# EAGLE design LoRaBaseBoard (EAGLE 9.6.2)
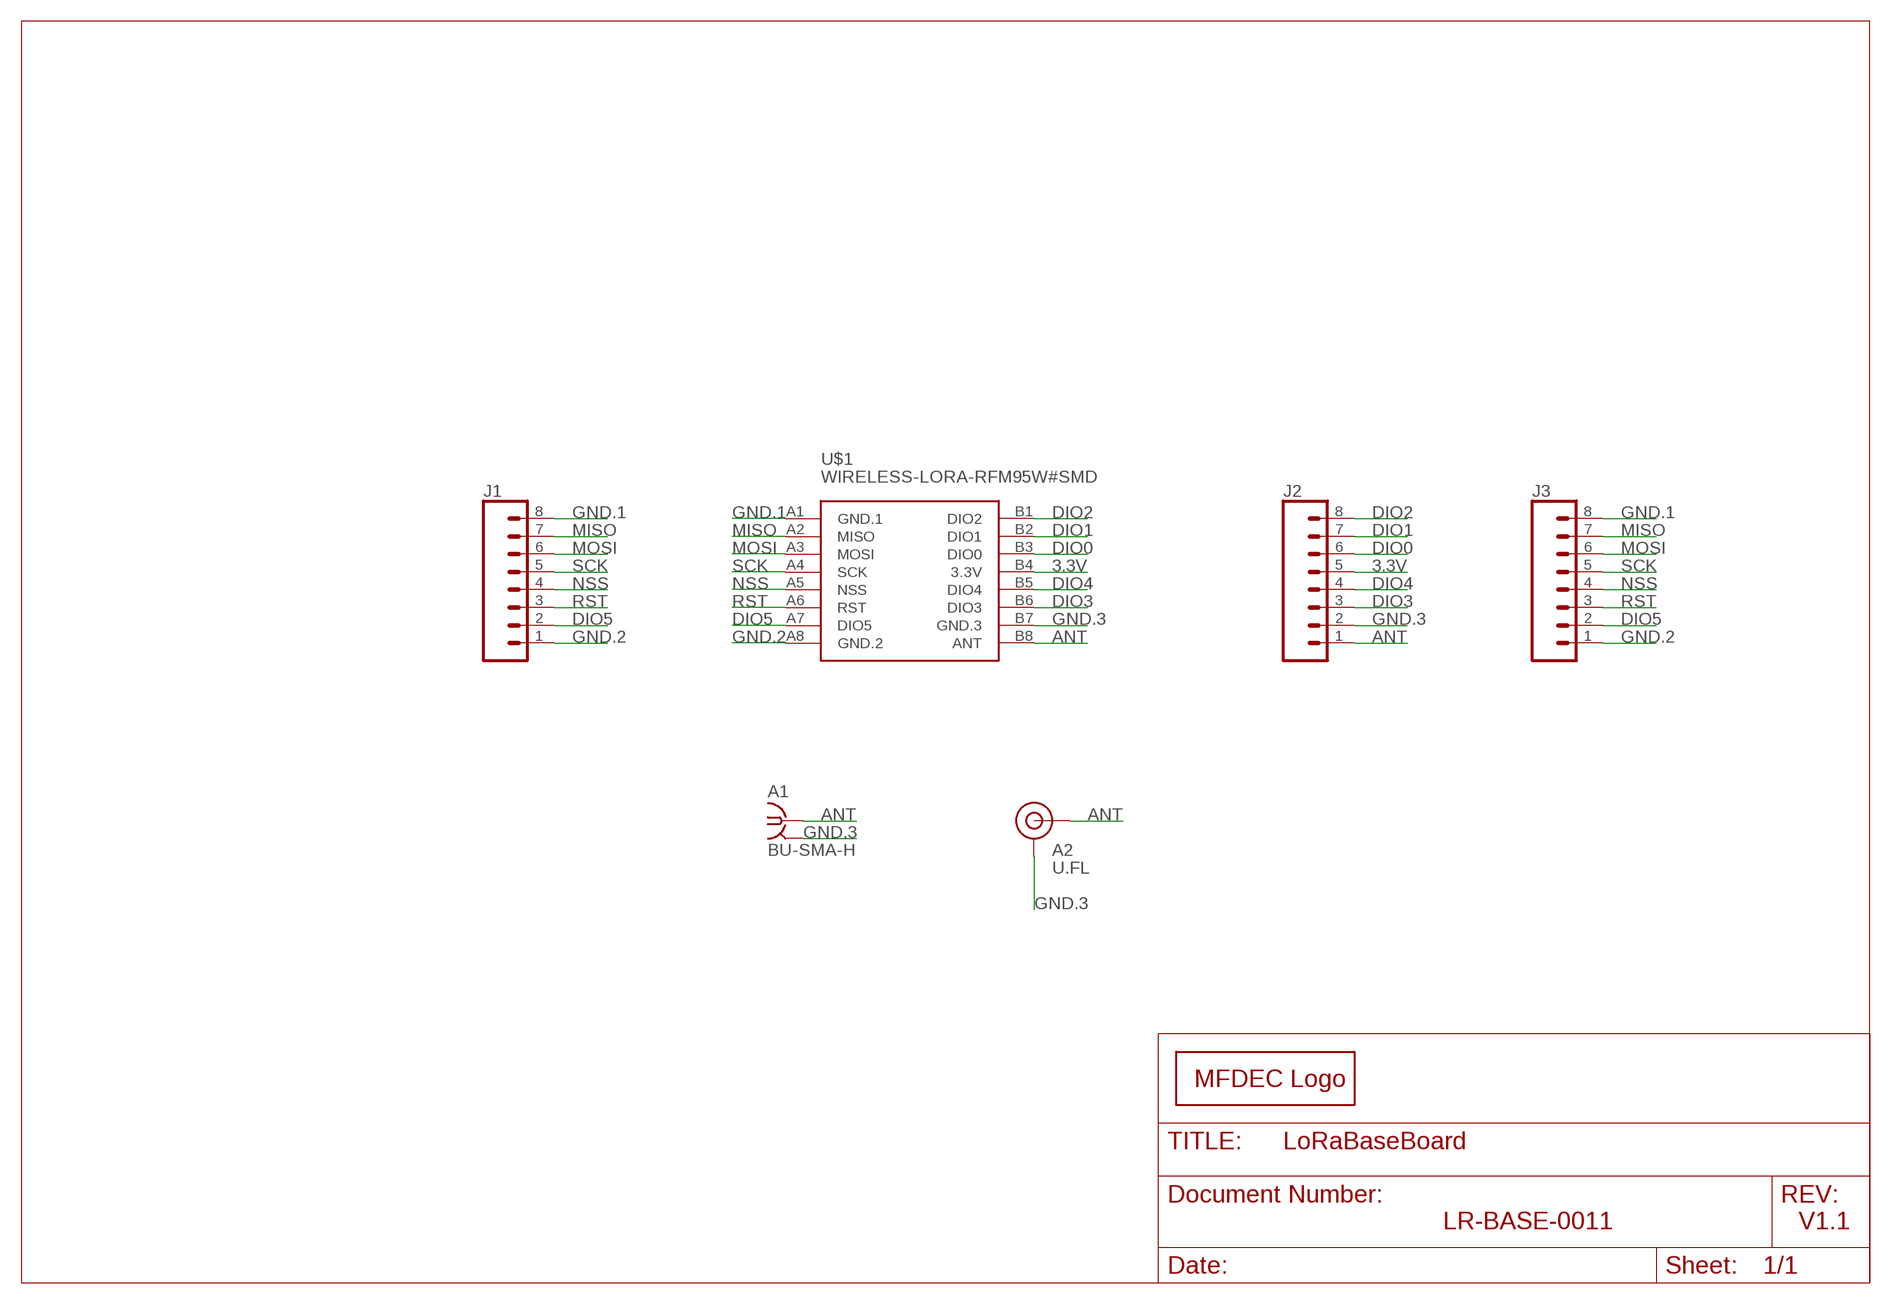
[diagram p0: schematic, sheet 1]

## Parts
A1  BU-SMA-H  [BU-SMA-H]
A2  U.FL  U.FL2PIN  [U.FL]
J1  CONN_08NO_SILK_FEMALE_PTH  [1X08_NO_SILK]
J2  CONN_08NO_SILK_FEMALE_PTH  [1X08_NO_SILK]
J3  CONN_08NO_SILK_FEMALE_PTH  [1X08_NO_SILK]
LOGO1  MFDECLOGO_SQ_8MM  [MFDEC_SQ_8MM]
U$1  WIRELESS-LORA-RFM95W#SMD  [WIRELESS-LORA-RFM95W#SMD]

## Nets
3.3V: J2.5 U$1.B4(3.3V)
ANT: A1.1 A2.FEED(SIGNAL) J2.1 U$1.B8(ANT)
DIO0: J2.6 U$1.B3(DIO0)
DIO1: J2.7 U$1.B2(DIO1)
DIO2: J2.8 U$1.B1(DIO2)
DIO3: J2.3 U$1.B6(DIO3)
DIO4: J2.4 U$1.B5(DIO4)
DIO5: J1.2 J3.2 U$1.A7(DIO5)
GND.1: J1.8 J3.8 U$1.A1(GND.1)
GND.2: J1.1 J3.1 U$1.A8(GND.2)
GND.3: A1.2 A1.3 A1.4 A1.5 A2.1(GND) A2.2(GND) J2.2 U$1.B7(GND.3)
MISO: J1.7 J3.7 U$1.A2(MISO)
MOSI: J1.6 J3.6 U$1.A3(MOSI)
NSS: J1.4 J3.4 U$1.A5(NSS)
RST: J1.3 J3.3 U$1.A6(RST)
SCK: J1.5 J3.5 U$1.A4(SCK)

## Notes on the sheet
- LR-BASE-0011 | V1.1

## Library data of the parts
A1 = con-coax:BU-SMA-H: FEMALE SMA CONNECTOR Radiall; OC_FARNELL: unknown; OC_NEWARK: unknown
A2 = SparkFun-Connectors:U.FL2PIN: SMD Antenna Connector - U.FL 2mm height, 3.0mm x 3.0mm receptacle size. SparkFun Products: SparkFun WiFi Shield - ESP8266 <https://www.sparkfun.com/products/13287> SparkFun ESP8266 Thing <https://www.sparkfun.com/products/13231> SparkFun MiniGen - Pro Mini Signal Generator Shield <https://www.sparkfun.com/products/11420>; PROD_ID: CONN-09193; SF_ID: WRL-09144
J1-J3 = SparkFun-Connectors:CONN_08: Multi connection point. Often used as Generic Header-pin footprint for 0.1 inch spaced/style header connections On any of the 0.1 inch spaced packages, you can populate with these: Break Away Headers - Straight <https://www.sparkfun.com/products/116> (PRT-00116) Break Away Male Headers - Right Angle <https://www.sparkfun.com/products/553> (PRT-00553) Female Headers <https://www.sparkfun.com/products/115> (PRT-00115) Break Away Headers - Machine Pin <https://www.sparkfun.com/products/117> (PRT-00117) Break Away Female Headers - Swiss Machine Pin <https://www.sparkfun.com/products/743> (PRT-00743) Arduino Stackable Header - 8 Pin <https://www.sparkfun.com/products/9279> (PRT-09279) For SCREWTERMINALS and SPRING TERMINALS visit here: Screw Terimnals on SparkFun.com <https://www.sparkfun.com/search/results?term=Screw+Terminals> (5mm/3.5mm/2.54mm spacing) This device is also useful as a general connection point to wire up your design to another part of your project. Our various solder wires solder well into these plated through hole pads. Hook-Up Wire - Assortment (Stranded, 22 AWG) <https://www.sparkfun.com/products/11375> (PRT-11375) Hook-Up Wire - Assortment (Solid Core, 22 AWG) <https://www.sparkfun.com/products/11367> (PRT-11367) View the entire wire category on our website here <https://www.sparkfun.com/categories/141> Special notes: Molex polarized connector foot print use with SKU : PRT-08231 with associated crimp pins and housings. 1MM SMD Version SKU: PRT-10208 NOTES ON THE VARIANTS LOCK and LOCK_LONGPADS... This footprint was designed to help hold the alignment of a through-hole component (i.e. 6-pin header) while soldering it into place. You may notice that each hole has been shifted either up or down by 0.005 of an inch from it's more standard position (which is a perfectly straight line). This slight alteration caused the pins (the squares in the middle) to touch the edges of the holes. Because they are alternating, it causes a "brace" to hold the component in place. 0.005 has proven to be the perfect amount of "off-center" position when using our standard breakaway headers. Although looks a little odd when you look at the bare footprint, once you have a header in there, the alteration is very hard to notice. Also,if you push a header all the way into place, it is covered up entirely on the bottom side.; PROD_ID: CONN-08438
LOGO1 = _my_logos:MFDECLOGO: Midnight Fog - Digital Eye Candy LOGO
U$1 = diy-modules:WIRELESS-LORA-RFM95W: 868/915 MHz LoRa Radio Transceiver Module based on SX1276 chip Click here to find device on ebay.com <http://www.ebay.com/sch/RFM95W+transceiver>

## Board
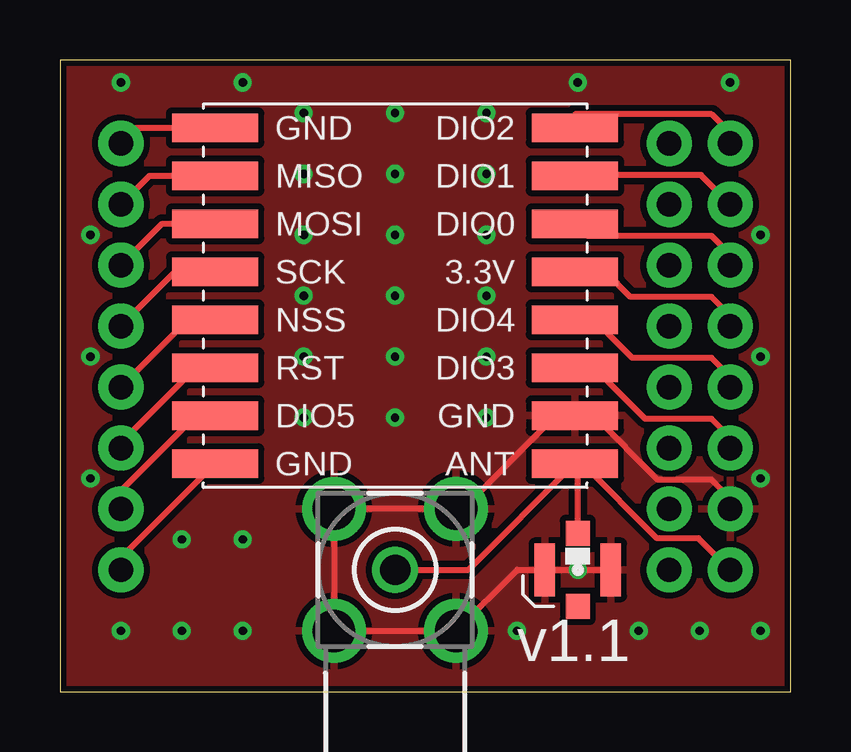
[diagram p1: board, top side]
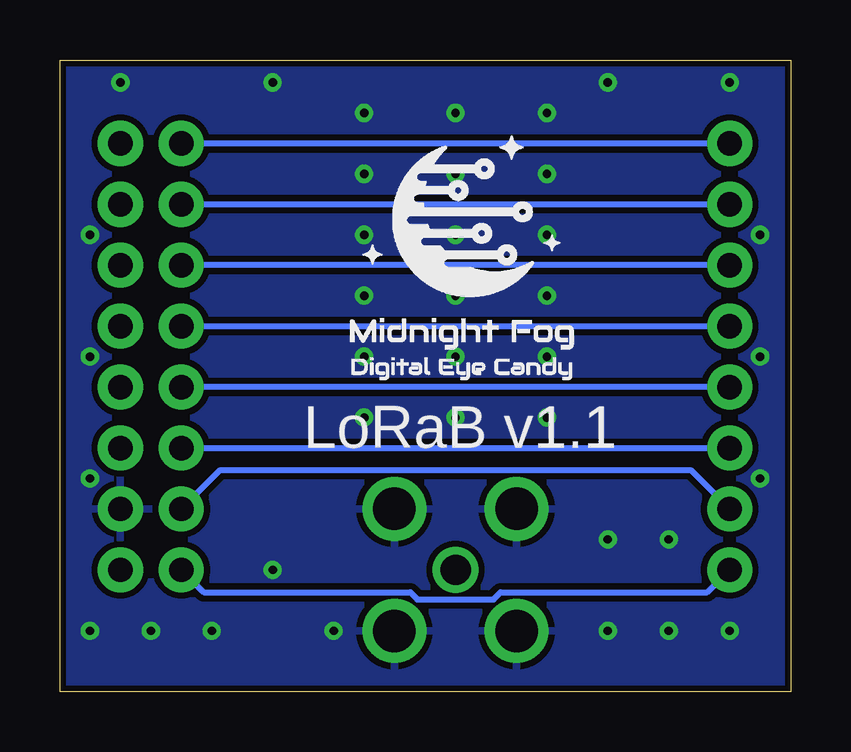
[diagram p2: board, bottom side, seen from below]

Size 30.46 x 26.34 mm. Coordinates in mm from the lower left corner, seen from the top.
Outline: 0,0 30.46,0 30.46,26.34 0,26.34 0,0
Copper layers (1*16): Top 0.035mm / dielectric 1.5mm / Bottom 0.035mm
Design rules "default *": minimum track width 6mil, minimum drill 0.35mm, track to track 6mil, track to pad 6mil, pad to pad 6mil, via to via 6mil, smd to smd 6mil, copper to edge 10mil, drill to drill 6mil, minimum pad ring 10mil, minimum via ring 8mil, stop-mask expansion 4mil, vias tented up to drill 15mil, thermal gap 10mil

### Footprints (pad centres in the part's own frame; a part is rotated, then mirrored left to right if it is on the bottom)
BU-SMA-H = drill 1.27: 1 0,0 | drill 1.778: 2 -2.55,2.55; 3 2.55,2.55; 4 2.55,-2.55; 5 -2.55,-2.55
U.FL = smd 2.2 x 0.85: 1 0,1.375; 2 0,-1.375 | smd 1.05 x 1: FEED 1.525,0; NC -1.525,0
1X08_NO_SILK = drill 1.016 pad 1.88: 1 0,0; 2 2.54,0; 3 5.08,0; 4 7.62,0; 5 10.16,0; 6 12.7,0; 7 15.24,0; 8 17.78,0
WIRELESS-LORA-RFM95W#SMD = smd 3.6 x 1.2: A1 -7.5,7; A2 -7.5,5; A3 -7.5,3; A4 -7.5,1; A5 -7.5,-1; A6 -7.5,-3; A7 -7.5,-5; A8 -7.5,-7; B1 7.5,7; B2 7.5,5; B3 7.5,3; B4 7.5,1; B5 7.5,-1; B6 7.5,-3; B7 7.5,-5; B8 7.5,-7

### Placement (x,y rotation side)
A1  13.97,5.08 270 top
A2  21.59,5.08 90 top
J1  2.54,5.08 90 top
J2  27.94,5.08 90 top
J3  25.4,5.08 90 top
LOGO1  19.05,12.7 0 bottom
U$1  13.97,16.51 0 top

### Tracks (layer width: path | path; a pad name or v marks a point on that pad's centre or on a via)
3.3V
  Top 0.254: J2.5 27.94,15.69 27.18,16.46 23.79,16.46 22.74,17.51 U$1.B4
ANT
  Top 0.254: 21.59,9.51 U$1.B8 21.45,9.51 17.02,5.08 A1.1 | A2.FEED 21.59,9.51 | 21.59,9.51 21.79,9.51 24.89,6.4 26.62,6.4 J2.1
DIO0
  Top 0.254: J2.6 27.94,18.23 27.18,19 21.98,19 U$1.B3
DIO1
  Top 0.254: U$1.B2 21.5,21.54 26.72,21.54 J2.7
DIO2
  Top 0.254: J2.8 27.94,23.31 27.18,24.08 21.47,24.08 U$1.B1
DIO3
  Top 0.254: U$1.B6 21.62,13.66 22.12,13.66 24.4,11.38 27.18,11.38 27.94,10.61 J2.3
DIO4
  Top 0.254: U$1.B5 22.27,15.51 23.86,13.92 27.18,13.92 27.94,13.15 J2.4
DIO5
  Top 0.254: J1.2 2.54,8.38 5.67,11.51 U$1.A7
  Bottom 0.254: J1.2 4.16,9.24 23.78,9.24 J3.2
GND.1
  Top 0.254: J1.8 3.19,23.51 U$1.A1
  Bottom 0.254: J1.8 J3.8
GND.2
  Top 0.254: J1.1 2.54,5.58 U$1.A8
  Bottom 0.254: J3.1 24.46,4.14 15.85,4.14 15.56,3.85 12.38,3.85 12.09,4.14 3.48,4.14 J1.1
GND.3  (via drill 0.35)
  Top 0.254: J2.2 27.94,8.07 27.18,8.84 24.94,8.84 22.27,11.51 U$1.B7 20.68,11.51 16.8,7.63 A1.2 A1.5 A1.4 A1.3 19.07,5.08 A2.1 v21.59,5.08 A2.2
  other vias: 13.97,11.43 2.54,2.54 7.62,6.35 26.67,2.54 13.97,13.97 13.97,19.05 13.97,16.51 13.97,21.59 13.97,24.13 2.54,25.4 27.94,25.4 10.16,24.13 10.16,21.59 10.16,19.05 10.16,16.51 10.16,13.97 10.16,11.43 5.08,6.35 5.08,2.54 7.62,2.54 24.13,2.54 29.21,2.54 17.78,11.43 17.78,13.97 17.78,16.51 17.78,19.05 17.78,21.59 17.78,24.13 29.21,19.05 29.21,13.97 1.27,19.05 1.27,13.97 1.27,8.89 19.05,2.54 29.21,8.89 21.59,25.4 7.62,25.4
  pour Top (isolate 0.254): 0,0 0,26.67 30.48,26.67 30.48,0
  pour Bottom (isolate 0.254): 0,0 0,26.67 30.48,26.67 30.48,0
MISO
  Top 0.254: J1.7 3.73,21.51 U$1.A2
  Bottom 0.254: J3.7 J1.7
MOSI
  Top 0.254: J1.6 4.27,19.51 U$1.A3
  Bottom 0.254: J1.6 J3.6
NSS
  Top 0.254: J1.4 5.35,15.51 U$1.A5
  Bottom 0.254: J1.4 J3.4
RST
  Top 0.254: J1.3 2.54,10.38 5.67,13.51 U$1.A6
  Bottom 0.254: J3.3 J1.3
SCK
  Top 0.254: J1.5 4.81,17.51 U$1.A4
  Bottom 0.254: J3.5 J1.5

### Text on the board
tPlace: v1.1
bPlace: LoRaB v1.1